# Altium schematic sheet ExtensionConnector.SchDoc: Extension Connectors
size A4; Date: Not used; ApprovedBy: Not used; CheckedBy: Not used; Author: Not used; CompanyName: STMicroelectronics; DrawnBy: Not used; Engineer: Not used; Organization: Not used; Address1: Not used; Address2: Not used; Address3: Not used; Address4: Not used; DocumentNumber: Not used; Revision: Not used; SheetNumber: 17; SheetTotal: 22; CurrentTime: Not used; CurrentDate: Not used; Time: Not used; DocumentFullPathAndName: Not used; DocumentName: Not used; ModifiedDate: Not used; ImagePath: Not used; ProjectName: Not used; Application_BuildNumber: Not used
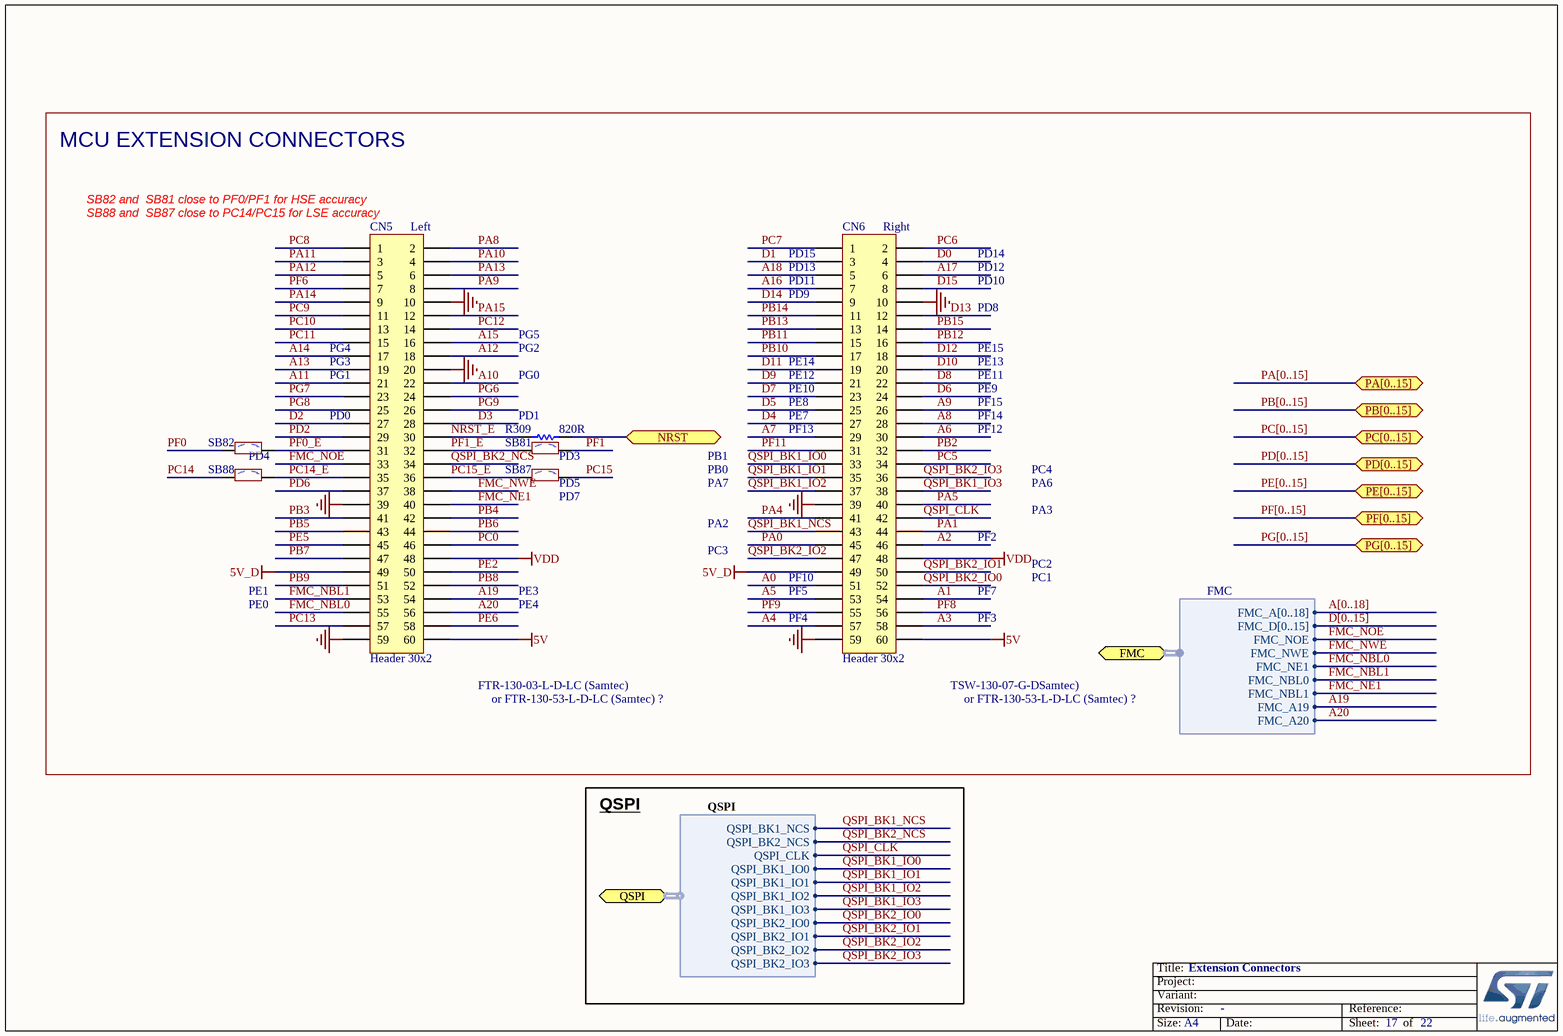
[diagram p0: ExtensionConnector.SchDoc]

## Parts
CN5  Header 30x2  [CON_SAMTEC_FTR-130-53-L-D-LC]
CN6  Header 30x2  [CON_SAMTEC_FTR-130-53-L-D-LC]
R309  value 820R  [R0402]  (hidden comment: Resistor)
SB81  SB_OFF  [SOLDER-BRIDGE_R0603-0R]  (value not drawn)
SB82  SB_OFF  [SOLDER-BRIDGE_R0603-0R]  (value not drawn)
SB87  SB_OFF  [SOLDER-BRIDGE_R0603-0R]  (value not drawn)
SB88  SB_OFF  [SOLDER-BRIDGE_R0603-0R]  (value not drawn)

## Ports
FMC (harness FMC), NRST, PA[0..15], PB[0..15], PC[0..15], PD[0..15], PE[0..15], PF[0..15], PG[0..15], QSPI (harness QSPI)

## Harnesses
FMC: FMC_NWE, FMC_NOE, FMC_NE1, FMC_A[0..18], FMC_D[0..15], FMC_NBL0, FMC_NBL1, FMC_A19, FMC_A20
QSPI: QSPI_BK1_IO1, QSPI_BK1_IO0, QSPI_CLK, QSPI_BK1_NCS, QSPI_BK1_IO2, QSPI_BK1_IO3, QSPI_BK2_IO1, QSPI_BK2_IO0, QSPI_BK2_IO2, QSPI_BK2_IO3, QSPI_BK2_NCS

## Nets
5V: CN5.60 CN6.60
5V_D: CN5.49 CN6.49
GND: CN5.10 CN5.20 CN5.39 CN5.59 CN6.10 CN6.39 CN6.59
VDD: CN5.48 CN6.48
A0: CN6.51
A1: CN6.54
A2: CN6.46
A3: CN6.58
A4: CN6.57
A5: CN6.53
A6: CN6.30
A7: CN6.29
A8: CN6.28
A9: CN6.26
A10: CN5.22
A11: CN5.21
A12: CN5.18
A13: CN5.19
A14: CN5.17
A15: CN5.16
A16: CN6.7
A17: CN6.6
A18: CN6.5
A19: CN5.54 ; port FMC.FMC_A19
A20: CN5.56 ; port FMC.FMC_A20
D0: CN6.4
D1: CN6.3
D2: CN5.27
D3: CN5.28
D4: CN6.27
D5: CN6.25
D6: CN6.24
D7: CN6.23
D8: CN6.22
D9: CN6.21
D10: CN6.20
D11: CN6.19
D12: CN6.18
D13: CN6.12
D14: CN6.9
D15: CN6.8
FMC_NBL0: CN5.55 ; port FMC.FMC_NE1
FMC_NBL1: CN5.53 ; port FMC.FMC_NBL0
FMC_NE1: CN5.40 ; port FMC.FMC_NBL1
FMC_NOE: CN5.33 ; port FMC.FMC_NOE
FMC_NWE: CN5.38 ; port FMC.FMC_NWE
NRST: R309.2 ; port NRST
NRST_E: CN5.30 R309.1
PA0: CN6.45
PA1: CN6.44
PA4: CN6.41
PA5: CN6.40
PA8: CN5.2
PA9: CN5.8
PA10: CN5.4
PA11: CN5.3
PA12: CN5.5
PA13: CN5.6
PA14: CN5.9
PA15: CN5.12
PB2: CN6.32
PB3: CN5.41
PB4: CN5.42
PB5: CN5.43
PB6: CN5.44
PB7: CN5.47
PB8: CN5.52
PB9: CN5.51
PB10: CN6.17
PB11: CN6.15
PB12: CN6.16
PB13: CN6.13
PB14: CN6.11
PB15: CN6.14
PC0: CN5.46
PC5: CN6.34
PC6: CN6.2
PC7: CN6.1
PC8: CN5.1
PC9: CN5.11
PC10: CN5.13
PC11: CN5.15
PC12: CN5.14
PC13: CN5.57
PC14: SB88.1
PC14_E: CN5.35 SB88.2
PC15: SB87.2
PC15_E: CN5.36 SB87.1
PD2: CN5.29
PD6: CN5.37
PE2: CN5.50
PE5: CN5.45
PE6: CN5.58
PF0: SB82.1
PF0_E: CN5.31 SB82.2
PF1: SB81.2
PF1_E: CN5.32 SB81.1
PF6: CN5.7
PF8: CN6.56
PF9: CN6.55
PF11: CN6.31
PG6: CN5.24
PG7: CN5.23
PG8: CN5.25
PG9: CN5.26
QSPI_BK1_IO0: CN6.33 ; port QSPI.QSPI_BK1_IO0
QSPI_BK1_IO1: CN6.35 ; port QSPI.QSPI_BK1_IO1
QSPI_BK1_IO2: CN6.37 ; port QSPI.QSPI_BK1_IO2
QSPI_BK1_IO3: CN6.38 ; port QSPI.QSPI_BK1_IO3
QSPI_BK1_NCS: CN6.43 ; port QSPI.QSPI_BK1_NCS
QSPI_BK2_IO0: CN6.52 ; port QSPI.QSPI_BK2_IO0
QSPI_BK2_IO1: CN6.50 ; port QSPI.QSPI_BK2_IO1
QSPI_BK2_IO2: CN6.47 ; port QSPI.QSPI_BK2_IO2
QSPI_BK2_IO3: CN6.36 ; port QSPI.QSPI_BK2_IO3
QSPI_BK2_NCS: CN5.34 ; port QSPI.QSPI_BK2_NCS
QSPI_CLK: CN6.42 ; port QSPI.QSPI_CLK

## Buses and harness runs
bus A[0..18]
bus D[0..15]
bus PA[0..15] = port PA[0..15]
bus PB[0..15] = port PB[0..15]
bus PC[0..15] = port PC[0..15]
bus PD[0..15] = port PD[0..15]
bus PE[0..15] = port PE[0..15]
bus PF[0..15] = port PF[0..15]
bus PG[0..15] = port PG[0..15]

## Notes on the sheet
- MCU EXTENSION CONNECTORS
- (near CN5) SB82 and  SB81 close to PF0/PF1 for HSE accuracy
- (near CN5) SB88 and  SB87 close to PC14/PC15 for LSE accuracy
- (near CN5) Left
- (near CN6) Right
- (near CN6) PD9
- (near CN6) PD11
- (near CN6) PD13
- (near CN6) PD15
- PD8
- PD10
- PD12
- PD14
- (near CN5) PG1
- (near CN5) PG3
- (near CN5) PG4
- PG0
- PG2
- PG5
- (near CN6) PE12
- (near CN6) PE14
- PE11
- PE13
- PE15
- (near CN5) PD0
- (near R309) PD1
- (near CN6) PE8
- (near CN6) PE10
- (near CN6) PF13
- (near CN6) PE7
- PE9
- PF12
- PF14
- PF15
- (near SB82) PD4
- (near SB87) PD5
- (near SB87) PD7
- (near SB81) PD3
- PB0
- PB1
- PA7
- PC4
- PA3
- PA6
- PC3
- PA2
- (near CN6) PF10
- PF2
- PC1
- PC2
- PE0
- PE1
- PE3
- PE4
- (near CN6) PF4
- (near CN6) PF5
- PF3
- PF7
- (near CN5) FTR-130-03-L-D-LC (Samtec)
- or FTR-130-53-L-D-LC (Samtec) ?
- (near CN6) TSW-130-07-G-DSamtec)
- QSPI
- Title:
- Project:
- Size:
- Revision:
- Variant:
- A4
- -
- Date:
- Reference:
- Sheet:
- of

## Library data of the parts
CN5 CN6 = MCD-00576: Header 30x2, 1.27mm, VR, CMS, Height 7.24mm; Part_Type: Connector; Manufacturer_Part_Number: FTR-130-53-L-D-LC; Manufacturer: SAMTEC; Alternate_Manufacturer_Part_Number: P1039-2*30MGF-089-1A; Alternate_Manufacturer: JIUBABA; Provided_By: SUBCO; Initial_Board_Reference: MB1331; Path: ws/MCD_ApplicationBoards/Lists/MCDPARTSdatabase; Item Type: Item; Internal_Part_Number: MCD-00576; Value: Header 30x2; Status: Checked; ComponentLink1Description: Datasheet; ComponentLink1URL: http://tunmcdsvn.tun.st.com/Component_Datasheet_Library/Trunk/Connectors/Samtec_FTR_smt_series
R309 = MCD-00527: Resistor,820R,0402,1%,1/16W; Manufacturer_Part_Number: RC0402FR-07820RL; Manufacturer: YAGEO; Provided_By: SUBCO; Initial_Board_Reference: MBxxxx; Path: ws/MCD_ApplicationBoards/Lists/MCDPARTSdatabase; Item Type: Item; Internal_Part_Number: MCD-00527; Status: Released; ComponentLink1Description: Datasheet; Part_Type: Resistor; Package: R0402; ComponentLink1URL: http://tunmcdsvn.tun.st.com/Component_Datasheet_Library/Trunk/Resistors/Yageo_Resistor_RC0402-series
SB81 SB82 SB87 SB88 = MCD-00072: Solder Bridge OFF; Part_Type: Mechanical; Manufacturer_Part_Number: RC0603JR-070RL; Manufacturer: YAGEO; Provided_By: SUBCO; Initial_Board_Reference: MB1274; Path: ws/MCD_ApplicationBoards/Lists/MCDPARTSdatabase; Item Type: Item; Internal_Part_Number: MCD-00072; Status: Released; ComponentLink1Description: Datasheet; Package: SB0603; ComponentLink1URL: http://tunmcdsvn.tun.st.com/Component_Datasheet_Library/Trunk/Resistors/Yageo_Resistor_RC0603-series